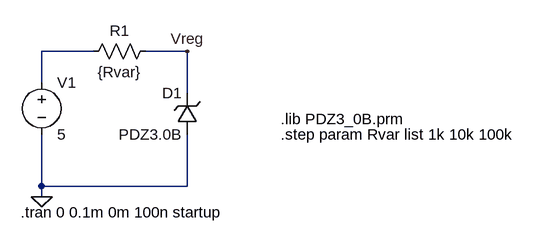
[diagram p0: schematic ZenerSim.asc]
ZenerSim.asc, the LTspice schematic file:
Version 4
SHEET 1 880 680
WIRE 64 128 -16 128
WIRE 208 128 144 128
WIRE -16 176 -16 128
WIRE 208 192 208 128
WIRE -16 336 -16 256
WIRE 208 336 208 256
WIRE 208 336 -16 336
WIRE -16 352 -16 336
FLAG -16 352 0
FLAG 208 128 Vreg
SYMBOL zener 224 256 R180
WINDOW 0 24 64 Left 2
WINDOW 3 24 0 Left 2
SYMATTR InstName D1
SYMATTR Value PDZ3.0B
SYMATTR Prefix X
SYMBOL voltage -16 160 R0
WINDOW 123 0 0 Left 0
WINDOW 39 0 0 Left 0
SYMATTR InstName V1
SYMATTR Value 5
SYMBOL res 160 112 R90
WINDOW 0 0 56 VBottom 2
WINDOW 3 32 56 VTop 2
SYMATTR InstName R1
SYMATTR Value {Rvar}
TEXT 352 232 Left 2 !.lib PDZ3_0B.prm
TEXT 352 256 Left 2 !.step param Rvar list 1k 10k 100k
TEXT -48 376 Left 2 !.tran 0 0.1m 0m 100n startup

The netlist it stands for:
* ZenerSim.asc
XD1 0 Vreg PDZ3.0B  ; pins + -
V1 N001 0 5
R1 Vreg N001 {Rvar}
.lib PDZ3_0B.prm
.step param Rvar list 1k 10k 100k
.tran 0 0.1m 0m 100n startup
.backanno
.end

* Results of the author's LTspice run, read from the files saved beside the schematic
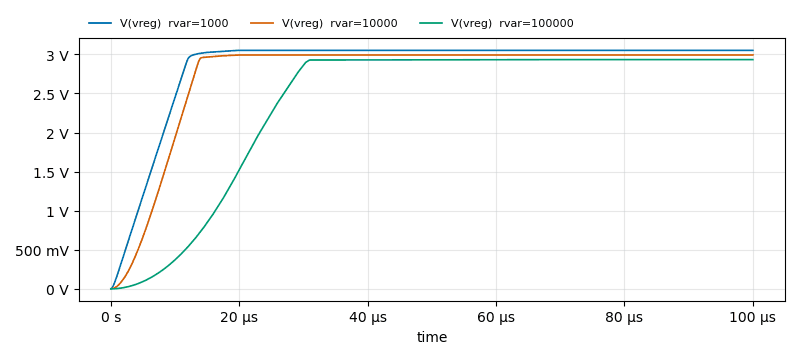
[diagram p1: Transient Analysis of ZenerSim.asc, plotted from the saved traces]
* Transient Analysis, 3 runs:
*   V(vreg) [rvar=1000]: min 0 V, max 3.051 V, average 2.856 V, rms 2.92 V, last 3.051 V
*   V(vreg) [rvar=10000]: min 0 V, max 2.992 V, average 2.747 V, rms 2.836 V, last 2.992 V
*   V(vreg) [rvar=100000]: min 0 V, max 2.933 V, average 2.375 V, rms 2.573 V, last 2.933 V